# Altium schematic sheet Power.SchDoc
size A4
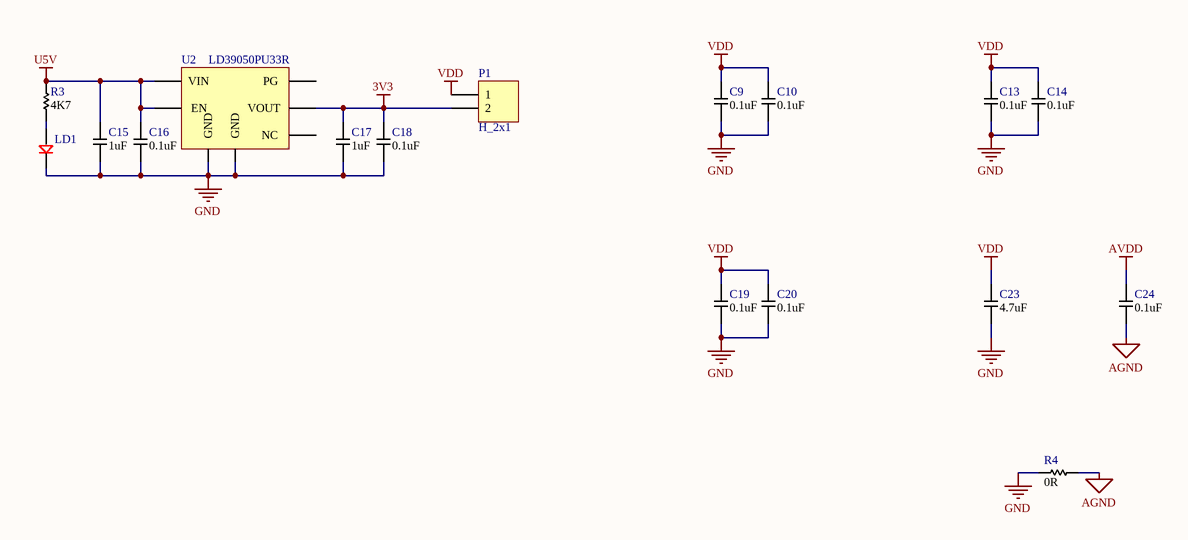
[diagram p0: Power.SchDoc]

## Parts
C9  value 0.1uF  [Kemet_0805_X7R]  (hidden comment: C0805C104K3RACTU)
C10  value 0.1uF  [Kemet_0805_X7R]  (hidden comment: C0805C104K3RACTU)
C13  value 0.1uF  [Kemet_0805_X7R]  (hidden comment: C0805C104K3RACTU)
C14  value 0.1uF  [Kemet_0805_X7R]  (hidden comment: C0805C104K3RACTU)
C15  value 1uF  [Kemet_0805_X7R]  (hidden comment: C0805C105K4RACTU)
C16  value 0.1uF  [Kemet_0805_X7R]  (hidden comment: C0805C104K3RACTU)
C17  value 1uF  [Kemet_0805_X7R]  (hidden comment: C0805C105K4RACTU)
C18  value 0.1uF  [Kemet_0805_X7R]  (hidden comment: C0805C104K3RACTU)
C19  value 0.1uF  [Kemet_0805_X7R]  (hidden comment: C0805C104K3RACTU)
C20  value 0.1uF  [Kemet_0805_X7R]  (hidden comment: C0805C104K3RACTU)
C23  value 4.7uF  [Kemet_0805_X7R]  (hidden comment: C0805C104K3RACTU)
C24  value 0.1uF  [Kemet_0805_X7R]  (hidden comment: C0805C104K3RACTU)
LD1  17-21/R6C-AP1Q2L/3T  [Everlight_17-21]  (value not drawn)
P1  H_2x1  [HEADER_HDRV2W65P254_2X1_508X254H945]
R3  value 4K7  [VISHAY_RESC205X125X50L35_30N]  (hidden comment: CRCW08050000Z0EA)
R4  value 0R  [VISHAY_RESC205X125X50L35_30N]  (hidden comment: CRCW08050000Z0EA)
U2  LD39050PU33R  [TI_SON7P95_300X300X100L40X34T236X162N]

## Nets
3V3: C17.2 C18.2 P1.2 U2.4(VOUT)
AGND: C24.1 R4.1
AVDD: C24.2
GND: C9.1 C10.1 C13.1 C14.1 C15.1 C16.1 C17.1 C18.1 C19.1 C20.1 C23.1 LD1.2(R-) R4.2 U2.2(GND) U2.7(GND)
U5V: C15.2 C16.2 R3.2 U2.1(EN) U2.6(VIN)
VDD: C9.2 C10.2 C13.2 C14.2 C19.2 C20.2 C23.2 P1.1
NetLD1_1: LD1.1(R+) R3.1

Not connected (* = marked no-connect by the designer): U2 3(PG) 5(NC)

## Library data of the parts
C9 C10 C13 C14 C16 C18-C20 C23 C24 = C0805C104K3RACTU: Cap_0805_0.1uF_25VDC_Kemet; Manufacturer: Kemet; Voltage: 25VDC; Tolerance: 10%; Dimensions: 2x1.25x0.9; Mounting Type: SMT; Package: 0805; Purchase Link: https://www.ozdisan.com/pasif-komponentler/kondansatorler/smd-kondansatorler-mlcc/C0805C105K4RACTU
C15 C17 = C0805C105K4RACTU: Cap_0805_1uF_16VDC_Kemet; Manufacturer: Kemet; Voltage: 16VDC; Tolerance: 2%; Dimensions: 2x1.25x0.9; Mounting Type: SMT; Package: 0805; Purchase Link: https://www.ozdisan.com/pasif-komponentler/kondansatorler/smd-kondansatorler-mlcc/C0805C105K4RACTU
LD1 = 17-21/R6C-AP1Q2L/3T: Led_R_1.7V_25mA_Everlight; Forward Current: 25mA; Forward Voltage: 1.7V; Color: R; Manufacturer: Everlight; Package: 0805; Dimensions: -; Mounting Type: SMT; Purchase Link: https://www.ozdisan.com/led-led-aydinlatma-cozumleri/led-komponentler/renkli-led-sinyal/17-21R6C-AP1Q2L3T
P1 = H_2x1: Head_2x1_2.54; Pitch: 2.54mm; Position of Pins: V; Manufacturer: -; Number of Pins: 2x1; Mounting Type: TH; Purchase Link: -; Dimensions: -
R3 R4 = CRCW08050000Z0EA: Res_0805_0R_1/8W_Vishay; Manufacturer: Vishay; Power: 1/8W; Tolerance: Jumper; Dimensions: 2x1.25x0.45; Mounting Type: SMT; Package: 0805; Purchase Link: https://www.ozdisan.com/pasif-komponentler/direncler/smt-smd-direncler/CRCW08050000Z0EA
U2 = LD39050PU33R: LinReg_3.3V_500mA_200mV_ST; Manufacturer: ST; Output Voltage: 3.3V; Output Current: 500mA; Dropout Voltage: 200mV; Dimensions: -; Package: DFN6(3x3); Mounting Type: SMT; Purchase Link: https://www.ozdisan.com/entegre-devreler-ics/guc-entegreleri/ic-lineer-voltaj-regulatorleri/LD39050PU33R